# EAGLE design LCD_Disp_AIR (EAGLE 6.5.0)
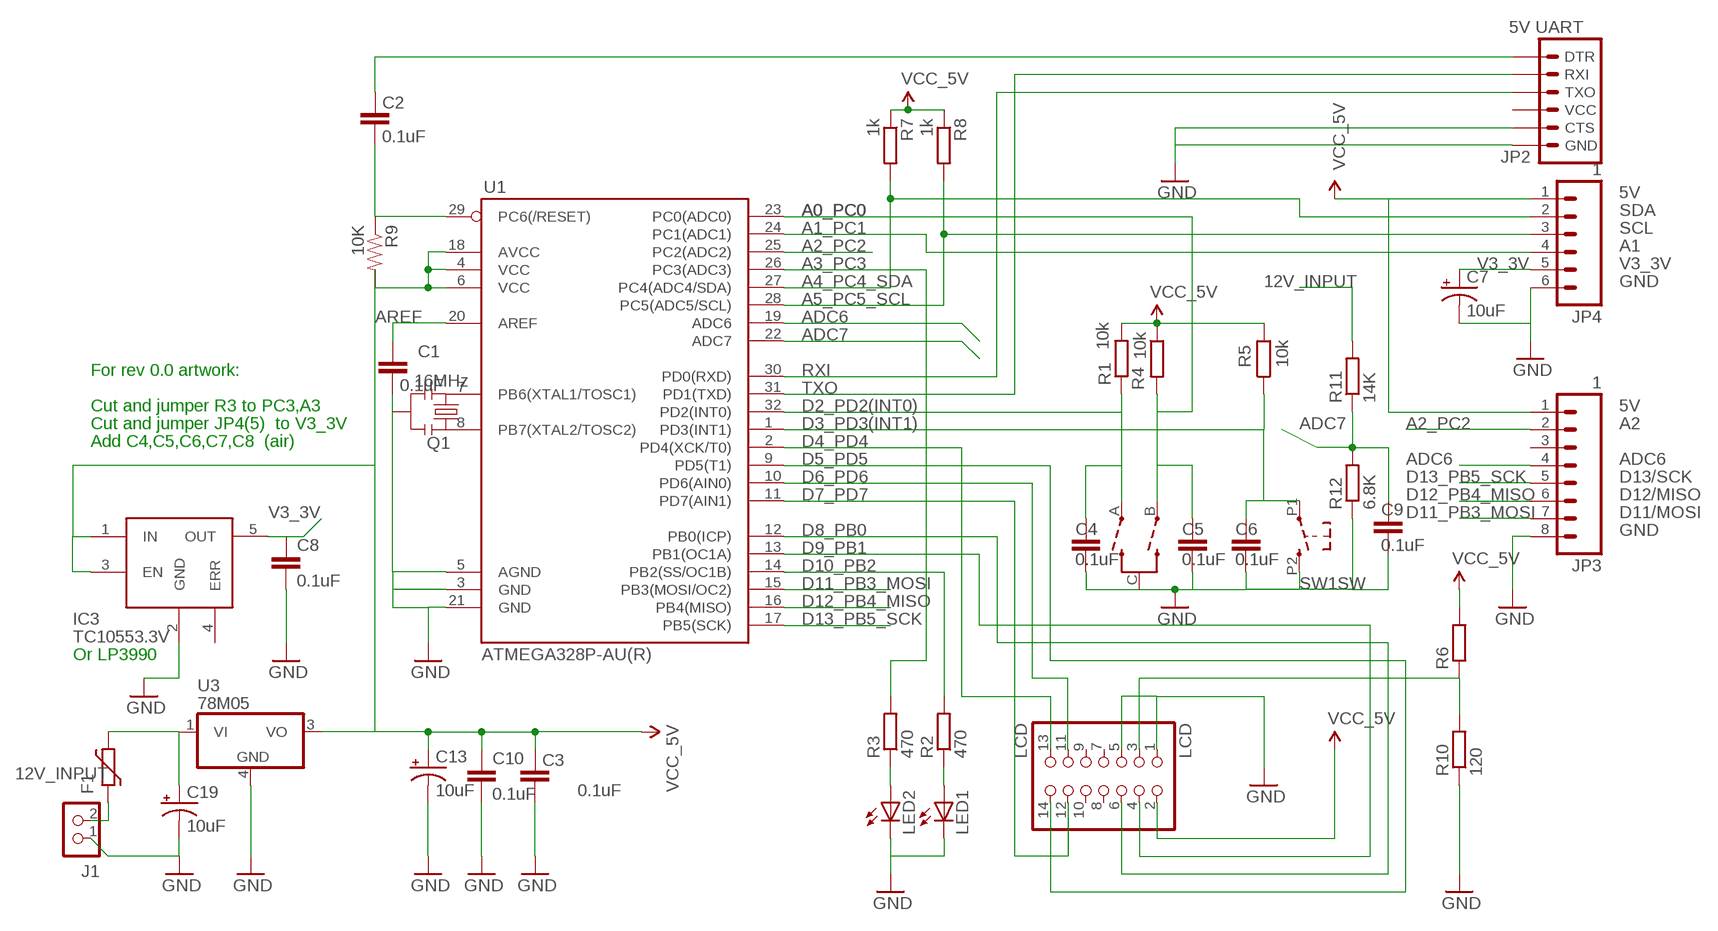
[diagram p0: schematic, sheet 1]

## Parts
C1  0.1uF  CAP0805  [0805]
C2  0.1uF  CAP0805  [0805]
C3  0.1uF  CAP0805  [0805]
C4  0.1uF  CAP0805  [0805]
C5  0.1uF  CAP0805  [0805]
C6  0.1uF  CAP0805  [0805]
C7  10uF  CAP_POL1206  [EIA3216]
C8  0.1uF  CAP0805  [0805]
C9  0.1uF  CAP0805  [0805]
C10  0.1uF  CAP0805  [0805]
C13  10uF  CAP_POL1206  [EIA3216]
C19  10uF  CAP_POL7343  [EIA7343]
F1  FUSE_PTC-0805  [PTC0805]
IC3  TC10553.3V  [SOT23-5]
J1  12V input  CON_HEADER_1X02-PTH  [M1X2]
JP2  5V UART  ARDUINO_SERIAL_PROGRAMPTH  [1X06]
JP3  1  M081X08  [1X08]
JP4  1  M06SIP  [1X06]
LCD  LCD  PINHD-2X7  [2X07]
LED1  LED-5MM  [LED-5MM]
LED2  LED-5MM  [LED-5MM]
Q1  16MHz  RESONATORSMD  [RESONATOR-SMD]
R1  10k  RESISTOR-0603  [R603]
R2  470  RESISTOR-0603  [R603]
R3  470  RESISTOR-0603  [R603]
R4  10k  RESISTOR-0603  [R603]
R5  10k  RESISTOR-0603  [R603]
R6  RESISTOR-0603  [R603]
R7  1k  RESISTOR-0603  [R603]
R8  1k  RESISTOR-0603  [R603]
R9  10K  RESISTOR0603  [0603]
R10  120  RESISTOR-0603  [R603]
R11  14K  RESISTOR-0603  [R603]
R12  6.8K  RESISTOR-0603  [R603]
SW1  ENCODER_SW1-PEC12  [PEC12_INCREMENTAL_ENCODER]
U1  ATMEGA328P-AU(R)  ATMEGA168  [TQFP32-08]
U3  78M05  78MXXL  [DPACK]

## Nets
5V: C3.2 C10.1 C13.A(+) IC3.1(IN) IC3.3(EN) JP3.1 JP4.1 LCD.2 R1.2 R4.1 R5.2 R6.2 R7.1 R8.1 R9.2 U1.4(VCC) U1.6(VCC) U1.18(AVCC) U3.3(VO) ; supply symbol labelled VCC_5V
12V_INPUT: C19.A(+) F1.2 R11.2 U3.1(VI)
A0_PC0: C5.2 R4.2 SW1.B(ENCODER:B) U1.23(PC0(ADC0))
A1_PC1: JP4.4 U1.24(PC1(ADC1))
A2_PC2: JP3.2 U1.25(PC2(ADC2))
A3_PC3: R3.2 U1.26(PC3(ADC3))
A4_PC4_SDA: JP4.2 R7.2 U1.27(PC4(ADC4/SDA))
A5_PC5_SCL: JP4.3 R8.2 U1.28(PC5(ADC5/SCL))
ADC6: JP3.4 U1.19(ADC6)
ADC7: C9.1 R11.1 R12.2 U1.22(ADC7)
AREF: C1.2 U1.20(AREF)
D2_PD2(INT0): C4.2 R1.1 SW1.A(ENCODER:A) U1.32(PD2(INT0))
D3_PD3(INT1): C6.2 R5.1 SW1.P1 U1.1(PD3(INT1))
D4_PD4: LCD.13 U1.2(PD4(XCK/T0))
D5_PD5: LCD.14 U1.9(PD5(T1))
D6_PD6: LCD.11 U1.10(PD6(AIN0))
D7_PD7: LCD.12 U1.11(PD7(AIN1))
D8_PB0: LCD.6 U1.12(PB0(ICP))
D9_PB1: LCD.4 U1.13(PB1(OC1A))
D10_PB2: R2.2 U1.14(PB2(SS/OC1B))
D11_PB3_MOSI: JP3.7 U1.15(PB3(MOSI/OC2))
D12_PB4_MISO: JP3.6 U1.16(PB4(MISO))
D13_PB5_SCK: JP3.5 U1.17(PB5(SCK))
GND: C1.1 C3.1 C4.1 C5.1 C6.1 C7.C(-) C8.2 C9.2 C10.2 C13.C(-) C19.C(-) IC3.2(GND) J1.1 JP2.5(CTS) JP2.6(GND) JP3.8 JP4.6 LCD.1 LCD.5 LED1.K(C) LED2.K(C) Q1.2 R10.1 R12.1 SW1.C(ENCODER:C) SW1.P2 U1.3(GND) U1.5(AGND) U1.21(GND) U3.4(GND)
N$2: LCD.3 R6.1 R10.2
N$5: Q1.1 U1.8(PB7(XTAL2/TOSC2))
N$6: C2.2 JP2.1(DTR)
N$9: Q1.3 U1.7(PB6(XTAL1/TOSC1))
N$11: F1.1 J1.2
N$13: LED1.A R2.1
N$15: LED2.A R3.1
RESET: C2.1 R9.1 U1.29(PC6(/RESET))
RXI: JP2.3(TXO) U1.30(PD0(RXD))
TXO: JP2.2(RXI) U1.31(PD1(TXD))
V3_3V: C7.A(+) C8.1 IC3.5(OUT) JP4.5
Unconnected: IC3.4(ERR) JP2.4(VCC) JP3.3 LCD.7 LCD.8 LCD.9 LCD.10

## Notes on the sheet
- 5V
- SDA
- SCL
- A1
- GND
- For rev 0.0 artwork:
- Cut and jumper R3 to PC3,A3 | 5V
- Cut and jumper JP4(5)  to V3_3V | A2
- Add C4,C5,C6,C7,C8  (air)
- ADC6
- D13/SCK
- D12/MISO
- D11/MOSI
- GND
- Or LP3990

## Library data of the parts
C1-C6 C8-C10 = SparkFun:CAP: Capacitor Standard 0603 ceramic capacitor, and 0.1" leaded capacitor.
C7 C13 C19 = SparkFun:CAP_POL: Capacitor Polarized These are standard SMD and PTH capacitors. Normally 10uF, 47uF, and 100uF in electrolytic and tantalum varieties. Always verify the external diameter of the through hole cap, it varies with capacity, voltage, and manufacturer. The EIA devices should be standard.
F1 = dp_devices:FUSE_PTC: Resettable PTC
IC3 = 1AA_Stofer:TC10553.3V
J1 = dp_devices:CON_HEADER_1X02
JP2 = SparkFun:ARDUINO_SERIAL_PROGRAM
JP3 = SparkFun-Connectors:M08: Header 8 Standard 8-pin 0.1" header. Use with straight break away headers (SKU : PRT-00116), right angle break away headers (PRT-00553), swiss pins (PRT-00743), machine pins (PRT-00117), and female headers (PRT-00115).
JP4 = SparkFun-Connectors:M06: Header 6 Standard 6-pin 0.1" header. Use with straight break away headers (SKU : PRT-00116), right angle break away headers (PRT-00553), swiss pins (PRT-00743), machine pins (PRT-00117), and female headers (PRT-00115). Molex polarized connector foot print use with SKU : PRT-08094 with associated crimp pins and housings. NOTES ON THE VARIANTS LOCK and LOCK_LONGPADS... This footprint was designed to help hold the alignment of a through-hole component (i.e. 6-pin header) while soldering it into place. You may notice that each hole has been shifted either up or down by 0.005 of an inch from it's more standard position (which is a perfectly straight line). This slight alteration caused the pins (the squares in the middle) to touch the edges of the holes. Because they are alternating, it causes a "brace" to hold the component in place. 0.005 has proven to be the perfect amount of "off-center" position when using our standard breakaway headers. Although looks a little odd when you look at the bare footprint, once you have a header in there, the alteration is very hard to notice. Also, if you push a header all the way into place, it is covered up entirely on the bottom side. This idea of altering the position of holes to aid alignment will be further integrated into the Sparkfun Library for other footprints. It can help hold any component with 3 or more connection pins.
LCD = pinhead:PINHD-2X7: PIN HEADER
LED1 LED2 = dp_devices:LED: Light Emitting Diode
Q1 = SparkFun:RESONATOR: Resonator Small SMD resonator. This is the itty bitty 10/20MHz resonators with built in caps. CSTCE10M0G55 and CSTCE20M0V53. Footprint has been reviewed closely but hasn't been tested yet.
R1-R8 R10-R12 = dp_devices:RESISTOR
R9 = SparkFun:RESISTOR: Resistor Basic schematic elements and footprints for 0603, 1206, and PTH 1/10th watt (small) resistors.
SW1 = dp_devices:ENCODER_SW1: Incremental Encoder with push switch
U1 = SparkFun:ATMEGA168
U3 = wifi_WX:78MXXL: VOLTAGE REGULATOR

## Net classes
1 vcc: width 0.254 mm

## Board
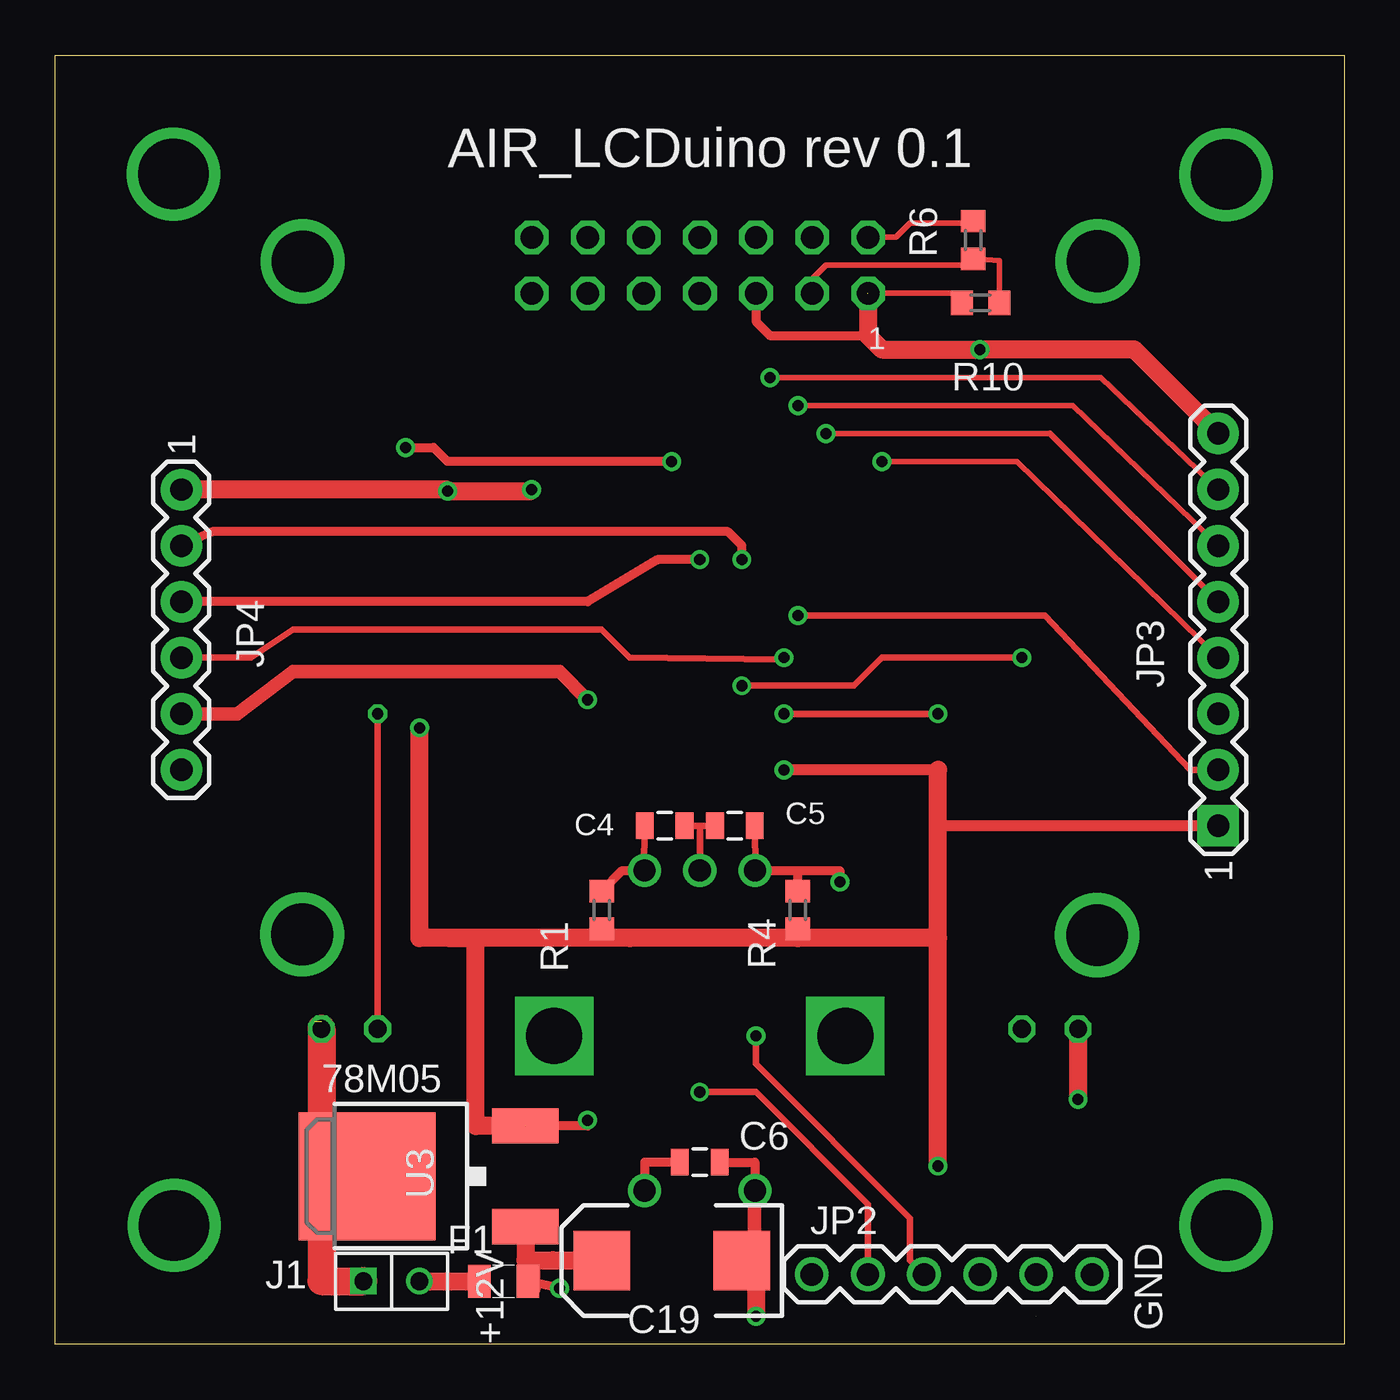
[diagram p1: board, top side]
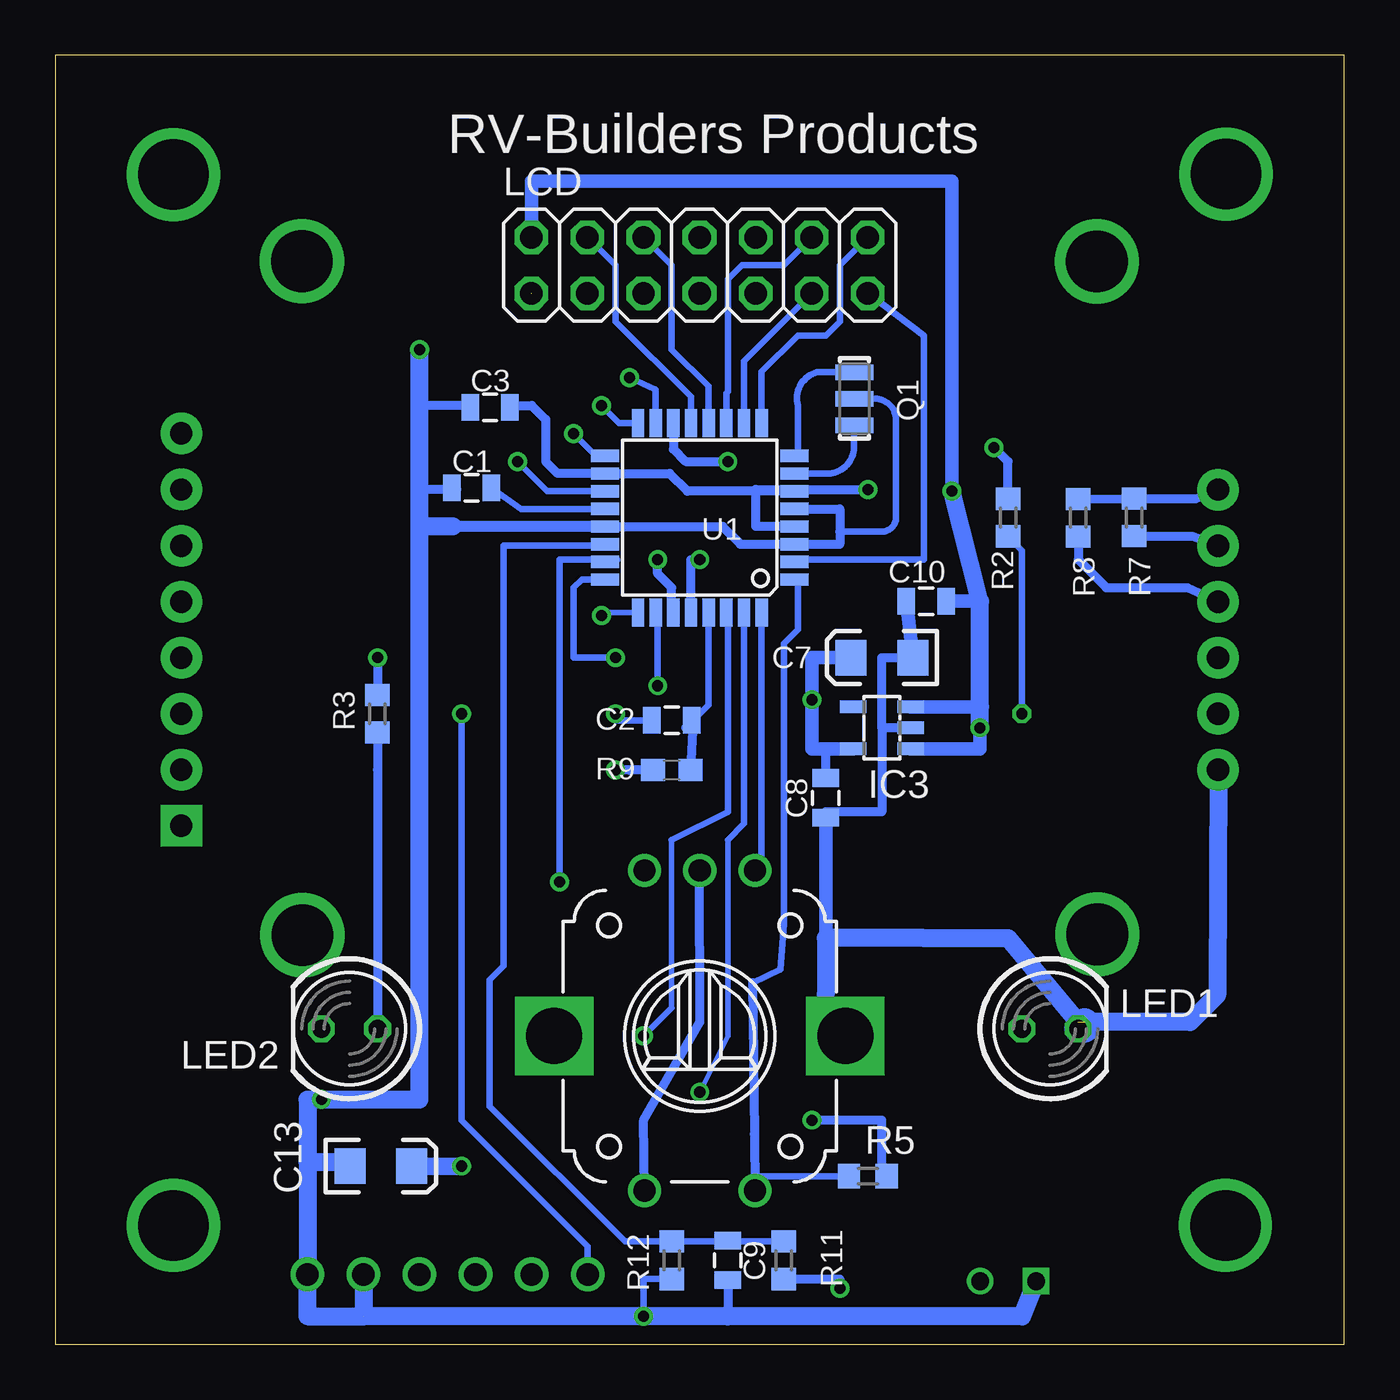
[diagram p2: board, bottom side, seen from below]

Size 58.42 x 58.42 mm. Coordinates in mm from the lower left corner, seen from the top.
Outline: 0,58.42 58.42,58.42 58.42,0 0,0 0,58.42
Copper layers (1*16): Top 0.0356mm / dielectric 1.5011mm / Bottom 0.0356mm
Design rules "OSH": minimum track width 6mil, minimum drill 13mil, track to track 6mil, track to pad 6mil, pad to pad 6mil, via to via 6mil, smd to smd 6mil, copper to edge 15mil, drill to drill 6mil, minimum pad ring 7mil, minimum via ring 7mil, stop-mask expansion 3mil, vias tented up to drill 0mil, thermal gap 10mil

### Footprints (pad centres in the part's own frame; a part is rotated, then mirrored left to right if it is on the bottom)
0805 = smd 0.8 x 1.2: 1 -0.9,0; 2 0.9,0
EIA3216 = smd 1.4 x 1.6: A 1.4,0; C -1.4,0
EIA7343 = smd 2.55 x 2.7: A 3.17,0; C -3.17,0
PTC0805 = smd 1 x 1.5: 1 -1.1,0; 2 1.1,0
SOT23-5 = smd 0.55 x 1.2: 1 -0.95,-1.3; 2 0,-1.3; 3 0.95,-1.3; 4 0.95,1.3; 5 -0.95,1.3
M1X2 = drill 0.8 square: 1 -1.27,0 | drill 0.8: 2 1.27,0
1X06 = drill 1.016: 1 0,0; 2 2.54,0; 3 5.08,0; 4 7.62,0; 5 10.16,0; 6 12.7,0
1X08 = drill 1.016 pad 1.88 square: 1 0,0 | drill 1.016 pad 1.88: 2 2.54,0; 3 5.08,0; 4 7.62,0; 5 10.16,0; 6 12.7,0; 7 15.24,0; 8 17.78,0
1X06' = drill 1.016 pad 1.88: 1 0,0; 2 2.54,0; 3 5.08,0; 4 7.62,0; 5 10.16,0; 6 12.7,0
2X07 = drill 1.016 octagon: 1 -7.62,-1.27; 2 -7.62,1.27; 3 -5.08,-1.27; 4 -5.08,1.27; 5 -2.54,-1.27; 6 -2.54,1.27; 7 0,-1.27; 8 0,1.27; 9 2.54,-1.27; 10 2.54,1.27; 11 5.08,-1.27; 12 5.08,1.27; 13 7.62,-1.27; 14 7.62,1.27
LED-5MM = drill 0.813 octagon: A -1.27,0; K 1.27,0
RESONATOR-SMD = smd 0.7 x 1.7: 1 -1.2,0; 2 0,0; 3 1.2,0
R603 = smd 1 x 1.1: 1 -0.85,0; 2 0.85,0
0603 = smd 1.1 x 1: 1 -0.85,0; 2 0.85,0
PEC12_INCREMENTAL_ENCODER = drill 1: A -2.5,-7.5; B 2.5,-7.5; C 0,-7.5; P1 -2.5,7; P2 2.5,7 | drill 2.54 square: GND@1 -6.6,0; GND@2 6.6,0
TQFP32-08 = smd 1.27 x 0.559: 1 -4.293,2.8; 2 -4.293,2; 3 -4.293,1.2; 4 -4.293,0.4; 5 -4.293,-0.4; 6 -4.293,-1.2; 7 -4.293,-2; 8 -4.293,-2.8; 17 4.293,-2.8; 18 4.293,-2; 19 4.293,-1.2; 20 4.293,-0.4; 21 4.293,0.4; 22 4.293,1.2; 23 4.293,2; 24 4.293,2.8 | smd 0.559 x 1.27: 9 -2.8,-4.293; 10 -2,-4.293; 11 -1.2,-4.293; 12 -0.4,-4.293; 13 0.4,-4.293; 14 1.2,-4.293; 15 2,-4.293; 16 2.8,-4.293; 25 2.8,4.293; 26 2,4.293; 27 1.2,4.293; 28 0.4,4.293; 29 -0.4,4.293; 30 -1.2,4.293; 31 -2,4.293; 32 -2.8,4.293
DPACK = smd 1.6 x 3: 1 -2.28,-4.8; 3 2.28,-4.8 | smd 5.8 x 6.2: 4 0,2.38

### Placement (x,y rotation side)
C1  39.55,38.81 0 bottom
C2  30.48,28.28 180 bottom
C3  38.71,42.47 0 bottom
C4  27.62,23.5 180 top
C5  30.8,23.5 0 top
C6  29.21,8.25 180 top
C7  20.96,31.12 180 bottom
C8  23.5,24.77 270 bottom
C9  27.94,3.81 270 bottom
C10  18.95,33.68 180 bottom
C13  43.66,8.08 0 bottom
C19  27.95,3.8 180 top
F1  20.32,2.86 0 top
IC3  20.96,27.94 90 bottom
J1  15.24,2.86 0 top
JP2  34.29,3.17 0 top
JP3  52.71,23.5 90 top
JP4  1  [1X06']  5.72,38.73 270 top
LCD  29.22,48.9 0 bottom
LED1  13.34,14.3 0 bottom
LED2  45.09,14.3 180 bottom
Q1  22.2,42.85 270 bottom
R1  24.77,19.69 270 top
R2  15.24,37.47 90 bottom
R3  43.81,28.57 90 bottom
R4  33.66,19.69 90 top
R5  21.59,7.62 0 bottom
R6  41.61,50.04 90 top
R7  9.53,37.48 270 bottom
R8  12.06,37.46 270 bottom
R9  30.48,26.03 180 bottom
R10  41.94,47.19 0 top
R11  25.4,3.81 270 bottom
R12  30.48,3.81 90 bottom
SW1  29.21,13.97 180 bottom
U1  29.21,37.46 180 bottom
U3  16.51,7.62 90 top

### Tracks (layer width: path | path; a pad name or v marks a point on that pad's centre or on a via)
5V  (via drill 0.5)  (1 unrouted)
  Top 0.254: LCD.2 38.1,50.17 38.73,50.8 41.52,50.8 R6.2
  Top 0.406: R1.2 26.04,18.41 | v24.13,10.16 24.13,9.9 U3.3 | R4.1 33.66,18.41
  Top 0.508: JP3.1 40.64,23.5 40.01,23.5 40.01,26.04 33.66,26.04 v33.02,26.04
  Top 0.813: v21.59,38.73 21.51,38.66 v17.78,38.66 17.78,38.73 JP4.1 | v40.01,8.08 40.01,18.41 | 16.51,18.41 19.03,18.38 19.06,18.2 19.06,9.9 U3.3 | 16.51,18.41 v16.51,27.94 | 40.01,18.41 33.66,18.41 26.04,18.41 16.51,18.41 | 40.01,18.41 40.01,26.04
  Bottom 0.254: 26.67,38.1 26.67,38.73
  Bottom 0.406: U1.6 26.67,38.66 | 26.67,38.66 29.77,38.66 30.57,39.46 U1.18 35.65,39.46 36.2,40.01 36.2,41.91 36.83,42.55 37.98,42.55 C3.2 | 26.67,38.66 26.67,38.1 26.67,37.06 U1.4 | 26.67,38.73 v21.59,38.73 | R8.1 R7.1 6.73,38.33 JP4.1 | R9.2 32.39,26.03 v33.02,26.04 | R5.2 20.96,7.62 20.96,10.16 v24.13,10.16
  Bottom 0.61: IC3.3 16.51,28.89 | v16.51,27.94 16.51,26.99 IC3.1 | 16.51,33.68 C10.1 | LCD.2 36.83,52.7 17.78,52.7 v17.78,38.66
  Bottom 0.813: 16.51,33.66 v17.78,38.66 | C13.A v40.01,8.08 | v16.51,27.94 16.51,28.89 16.51,33.66 | 16.51,33.66 16.51,33.68
12V_INPUT  (via drill 0.5)
  Top 0.406: v22.86,2.54 F1.2
  Top 0.813: C19.A 22.55,3.81 21.59,3.81 | U3.1 21.31,3.81 21.59,3.81 | F1.2 21.59,2.54 21.59,3.81
  Bottom 0.406: R11.2 22.86,2.96 v22.86,2.54
A0_PC0  (via drill 0.5)
  Top 0.305: C5.2 31.77,21.47
  Top 0.406: SW1.B 31.77,21.47 33.66,21.47 | 33.66,21.47 35.56,21.47 v35.56,20.96 | R4.2 33.66,21.47
  Bottom 0.305: 33.02,35.56 35.56,35.56 v35.56,20.96
  Bottom 0.406: U1.23 33.02,35.56
A1_PC1  (via drill 0.5)
  Top 0.254: 32.94,31.04 v33.02,31.12
  Top 0.305: 32.94,31.04 26.04,31.12 24.77,32.38 10.8,32.38 8.89,31.12 JP4.4
  Bottom 0.305: U1.24 34.55,34.66 34.93,34.29 34.93,31.12 v33.02,31.12
A2_PC2  (via drill 0.5)
  Top 0.305: v33.66,33.02 44.86,33.02 51.44,26.04 JP3.2
  Bottom 0.254: U1.25 33.51,33.17 v33.66,33.02
A3_PC3  (via drill 0.5)
  Top 0.305: v31.12,29.84 36.2,29.84 37.47,31.12 v43.81,31.12
  Bottom 0.305: U1.26 31.12,33.17 v31.12,29.84
  Bottom 0.406: v43.81,31.12 R3.2
A4_PC4_SDA  (via drill 0.5)
  Top 0.406: v31.12,35.56 31.12,36.2 30.48,36.83 7.11,36.83 JP4.2
  Bottom 0.406: U1.27 30.48,33.24 30.48,34.29 31.12,34.93 v31.12,35.56 | R7.2 6.91,36.62 JP4.2
A5_PC5_SCL  (via drill 0.5)
  Top 0.406: v29.21,35.56 27.3,35.56 24.13,33.66 6.35,33.66 6.35,33.53 JP4.3
  Bottom 0.406: U1.28 29.61,35.56 v29.21,35.56 | R8.2 12.06,35.56 10.8,34.29 7.11,34.29 JP4.3
ADC6  (via drill 0.5)
  Top 0.254: v37.47,40.01 43.59,40.01 JP3.4
  Bottom 0.305: U1.19 36.12,38.66 v37.47,40.01
ADC7
  Bottom 0.305: U1.22 33.5,36.2 38.1,36.2 38.1,17.14 38.73,16.51 38.73,10.8 32.6,4.66 R12.2 27.94,4.66 | R11.1 27.94,4.66 | C9.1 27.94,4.66
AREF
  Bottom 0.305: U1.20 37.31,37.86 C1.2
D2_PD2(INT0)
  Top 0.305: C4.2 26.66,21.47
  Top 0.406: R1.1 25.7,21.47 26.66,21.47 SW1.A
  Bottom 0.305: U1.32 26.41,21.47 SW1.A
D3_PD3(INT1)
  Top 0.406: C6.2 26.71,8.25 SW1.P1
  Bottom 0.305: 26.82,16.39 25.55,17 25.4,19.05 25.4,31.75 24.77,32.38 24.77,34.66 U1.1 | R5.1 26.74,7.62 26.74,9.52
  Bottom 0.406: 26.82,16.39 26.74,9.52 SW1.P1
D4_PD4
  Bottom 0.254: 24.82,35.56 U1.2
  Bottom 0.305: LCD.13 19.05,45.71 19.05,35.56 24.91,35.56 U1.2
D5_PD5
  Bottom 0.305: U1.9 26.41,44.08 24.77,45.72 23.5,45.72 22.86,46.36 22.86,48.91 LCD.14
D6_PD6
  Bottom 0.254: LCD.11 24.14,47.62
  Bottom 0.305: 24.14,47.62 27.21,44.55 U1.10
D7_PD7
  Bottom 0.254: LCD.12 24.14,50.16 | 28.01,43.11 27.94,43.18
  Bottom 0.305: 24.14,50.16 25.4,48.9 27.3,48.9 27.94,48.26 27.94,43.18 | U1.11 28.01,43.11
D8_PB0
  Bottom 0.254: LCD.6
  Bottom 0.305: LCD.6 30.48,48.9 30.48,45.09 28.81,43.41 U1.12
D9_PB1
  Bottom 0.254: LCD.4
  Bottom 0.305: LCD.4 33.02,48.9 33.02,46.36 29.61,42.94 U1.13
D10_PB2  (via drill 0.5)
  Top 0.406: v27.94,40.01 17.78,40.01 17.14,40.64 v15.88,40.64
  Bottom 0.406: U1.14 30.41,40.57 29.84,40.01 v27.94,40.01 | R2.2 15.24,40.01 v15.88,40.64
D11_PB3_MOSI  (via drill 0.5)
  Top 0.254: v32.38,43.81 47.4,43.81 JP3.7
  Bottom 0.305: U1.15 31.21,43.27 v32.38,43.81
D12_PB4_MISO  (via drill 0.5)
  Top 0.254: v33.66,42.55 46.13,42.55 JP3.6
  Bottom 0.305: U1.16 32.86,41.75 v33.66,42.55
D13_PB5_SCK  (via drill 0.5)
  Top 0.254: v34.93,41.27 45.09,41.27
  Top 0.305: 45.09,41.27 JP3.5
  Bottom 0.254: U1.17 33.91,40.26
  Bottom 0.305: 33.91,40.26 v34.93,41.27
GND  (via drill 0.5)  (3 unrouted)
  Top 0.254: LCD.1 40.65,47.63 R10.1
  Top 0.305: C4.1 29.21,23.5 | 29.21,23.5 C5.1 | SW1.C 29.21,23.5
  Top 0.406: LCD.5 31.76,46.35 32.38,45.72 36.83,45.72 | C6.1 31.71,8.25 SW1.P2
  Top 0.61: SW1.P2 31.68,6.97 31.68,3.12
  Top 0.813: 36.83,47.62 36.83,45.72 37.47,45.09 v41.91,45.09 48.9,45.09 JP3.8 | C19.C 31.68,3.12 31.75,3.04 v31.75,1.27 | LED2.K v46.36,11.1
  Top 1.27: LED1.K 12.07,7.62 | 12.07,7.62 12.07,2.86 J1.1 | U3.4 12.07,7.62
  Bottom 0.254: Q1.2 21.26,42.85
  Bottom 0.305: 21.26,42.85 arc90 20.32,41.91 20.32,37.47 arc90 20.96,36.83 22.86,36.83 | R12.1 31.75,2.96 v31.75,1.27
  Bottom 0.406: U1.21 28.17,37.06 27.37,36.26 U1.3 22.86,36.26 22.86,36.83 22.86,37.86 U1.5 | C3.1 39.44,42.55 41.91,42.55 | 40.27,38.73 41.91,38.73 | SW1.P2 31.75,10.16 29.21,14.61 SW1.C | C9.2 27.94,1.27 | IC3.2 20.96,27.94 | 20.96,27.94 20.96,31.12 C7.C | 20.96,27.94 20.96,24.13 23.5,24.13 C8.2 | 19.05,18.41
  Bottom 0.508: U1.21 40.41,37.06 | C1.1 arc90 40.27,38.73
  Bottom 0.61: 23.5,18.41 | 23.5,18.41 C8.2 | C10.2 19.55,31.14 C7.C
  Bottom 0.813: 41.91,37.06 41.91,11.1 v46.36,11.1 46.99,11.1 46.99,8.25 | JP4.6 5.77,15.82 6.99,14.61 11.76,14.61 | 40.41,37.06 41.91,37.06 | 41.91,37.06 41.91,38.73 41.91,42.55 v41.91,45.09 | 46.99,8.25 46.99,2.54 JP2.6 46.99,1.27 44.45,1.27 JP2.5 | J1.1 14.61,1.27 27.94,1.27 v31.75,1.27 44.45,1.27 | 12.07,14.61 15.24,18.41 19.05,18.41 23.5,18.41 23.5,15.88 | C13.C 45.24,8.25 46.99,8.25
  Bottom 1.27: 11.76,14.61 11.76,14.3 LED1.K
N$1  (via drill 2.8)
  other vias: 11.22,49.07
N$2
  Top 0.254: LCD.3 34.3,48.27 34.93,48.9 41.95,48.9 R6.1 42.79,49.1 R10.2
N$3  (via drill 3.2)
  other vias: 53.06,53.01
N$4  (via drill 3.2)
  other vias: 5.36,53.04
N$5
  Bottom 0.254: 24.77,40.41 arc90 U1.8
  Bottom 0.305: Q1.1 23.89,44.05 arc-90 24.77,42.55 24.77,40.41
N$6  (via drill 0.5)
  Top 0.305: v33.02,28.57 v40.01,28.57
  Bottom 0.305: 31.47,28.57 C2.2 33.02,28.28 v33.02,28.57 | JP2.1 34.29,4.45 40.01,10.16 v40.01,28.57
N$7  (via drill 3.2)
  other vias: 53.06,5.38
N$8  (via drill 3.2)
  other vias: 5.38,5.38
N$9
  Bottom 0.254: 22.23,41.62 arc90 Q1.3
  Bottom 0.305: U1.7 23.4,39.46 arc-90 22.23,40.64 22.23,41.62
N$10  (via drill 2.8)
  other vias: 47.24,49.09
N$11
  Top 0.813: J1.2 F1.1
N$13  (via drill 0.5)
  Top 0.305: v14.61,28.57 LED1.A
  Bottom 0.305: R2.1 14.61,35.98 v14.61,28.57
N$14  (via drill 2.8)
  other vias: 11.2,18.58
N$15
  Bottom 0.406: 43.81,26.04 R3.1 LED2.A
N$16  (via drill 2.8)
  other vias: 47.21,18.54
RESET
  Bottom 0.305: U1.29 28.81,28.98 29.84,27.94
  Bottom 0.406: R9.1 29.51,28.25 C2.1 29.83,27.93 29.84,27.94
RXI  (via drill 0.5)
  Top 0.305: v31.75,13.97 31.75,12.7 38.73,5.72 38.73,3.81 JP2.3
  Bottom 0.254: U1.30 27.94,33.17 | 30.48,22.86 30.48,15.24
  Bottom 0.305: 27.94,33.17 27.94,24.13 30.48,22.86 | 30.48,15.24 v31.75,13.97
TXO  (via drill 0.5)
  Top 0.305: v29.21,11.43 31.75,11.43 36.83,6.35 JP2.2
  Bottom 0.254: 27.94,22.86 27.94,13.97 v29.21,11.43
  Bottom 0.305: U1.31 27.21,23.59 27.94,22.86
V3_3V  (via drill 0.5)
  Top 0.61: v24.13,29.21 22.86,30.48 10.8,30.48 8.25,28.57 JP4.5
  Bottom 0.406: C8.1 23.5,26.99
  Bottom 0.61: IC3.5 23.5,26.99 24.13,26.99 v24.13,29.21 24.13,31.12 C7.A

### Text on the board
tPlace: AIR_LCDuino rev 0.1 | 1 | +12V | GND
bPlace: RV-Builders Products